# Altium schematic sheet power.SchDoc: Power Supply
size A4; ApprovedBy: Yves Chevallier; CheckedBy: Yves Chevallier; Author: Yves Chevallier; CompanyName: EPFL; DrawnBy: Yves Chevallier; Engineer: Yves Chevallier; Organization: EPFL; Address1: EPFL; Address2: CH1015 Lausanne; Address3: +41(0)21 693 36 98; Address4: +41(0)21 693 26 00; DocumentNumber: ABC.00.0000.000.0; Revision: v1.0; SheetNumber: 0; SheetTotal: 0; DrawnByDate: 2000-01-01; ExecutionWarrantDate: 2000-01-01; ExecutionWarrant: Yves Chevallier; Context: Confidential; PageSetup: Record=PageOptions|CenterHorizontal=True|CenterVertical=False|PrintScale=0.97|XCorrection=1.00|YCorrection=1.00|PrintKind=0|BorderSize=5000000|LeftOffset=0|BottomOffset=0|Orientation=2|PaperLength=1000|PaperWidth=1000|Scale=100|PaperSource=262|PrintQuality=600|MediaType=1|DitherType=10|PaperKind=A4|PrintScaleMode=1; EngineerDate: 2000-01-01; CheckedByDate: 2000-01-01; SVN: OUI; ProjectName: PRJ
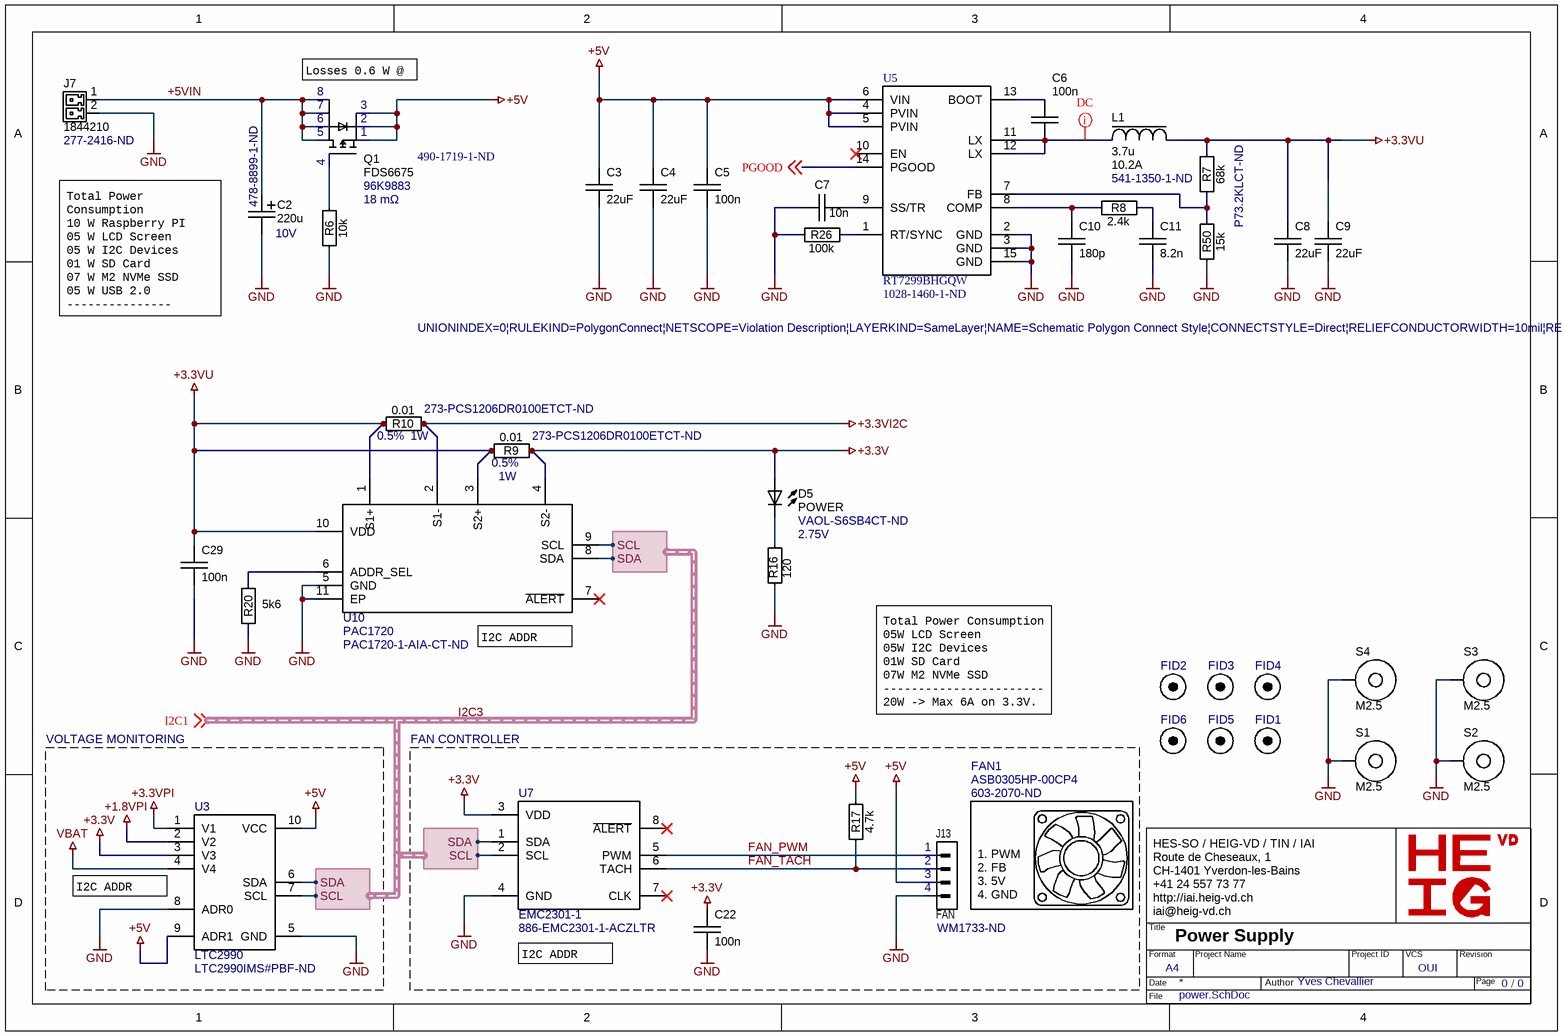
[diagram p0: power.SchDoc]

## Parts
C2  220u  Supplier Part Number 1: 478-8899-1-ND  Voltage: 10V  [CAPPM6032X280N]
C3  22uF  Rule: UNIONINDEX=0|RULEKIND=PolygonConnect|NETSCOPE=Violation Description|LAYERKIND=SameLayer|NAME=Schematic Polygon Connect Style|CONNECTSTYLE=Direct|RELIEFCONDUCTORWIDTH=10mil|RELIEFENTRIES=4|POLYGONRELIEFANGLE=45 Angle|AIRGAPWIDTH=10mil|UNIT=Imperial  Supplier Part Number 1: 490-1719-1-ND  [SM/C1210]
C4  22uF  [SM/C1210]
C5  100n  [SM/C0603]
C6  100n  [SM/C0603]
C7  10n  [SM/C0603]
C8  22uF  [SM/C1210]
C9  22uF  [SM/C1210]
C10  180p  [SM/C0603]
C11  8.2n  [SM/C0603]
C22  100n  [SM/C0603]
C29  100n  [SM/C0603]
D5  POWER  Supplier Part Number 1: VAOL-S6SB4CT-ND  Vf: 2.75V  [SM/LED0603]
FAN1  ASB0305HP-00CP4  Supplier Part Number 1: 603-2070-ND  (mechanical)
FID1  Fiducial 1.5 mm  [FIDUCIAL]  (value not drawn)  (no BOM)
FID2  Fiducial 1.5 mm  [FIDUCIAL]  (value not drawn)  (no BOM)
FID3  Fiducial 1.5 mm  [FIDUCIAL]  (value not drawn)  (no BOM)
FID4  Fiducial 1.5 mm  [FIDUCIAL]  (value not drawn)  (no BOM)
FID5  Fiducial 1.5 mm  [FIDUCIAL]  (value not drawn)  (no BOM)
FID6  Fiducial 1.5 mm  [FIDUCIAL]  (value not drawn)  (no BOM)
J7  1844210  Supplier Part Number 1: 277-2416-ND  [CONN2/PHOENIX/MC 1.5-2-G-3.5]
J13  FAN  [CONN4/MOLEX/1.25mm/53047-0410]
L1  3.7u  Isat: 10.2A  Supplier Part Number 1: 541-1350-1-ND  [IND_IHLP-3232DZ_VIS]
Q1  FDS6675  Supplier Part Number 1: 96K9883  Rdson: 18 mΩ  [SOIC8]
R6  10k  [SM/R0603]
R7  68k  Supplier Part Number 1: P73.2KLCT-ND  [SM/R0603]
R8  2.4k  [SM/R0603]
R9  0.01  Power: 1W  Precision: 0.5%  [SM/R1206]
R10  0.01  Power: 1W  Precision: 0.5%  [SM/R1206]
R16  120  [SM/R0603]
R17  4.7k  [SM/R0603]
R20  5k6  [SM/R0603]
R26  100k  [SM/R0603]
R50  15k  [SM/R0603]
S1  M2.5  [HW/HOLE/M2.5]  (no BOM)
S2  M2.5  [HW/HOLE/M2.5]  (no BOM)
S3  M2.5  [HW/HOLE/M2.5]  (no BOM)
S4  M2.5  [HW/HOLE/M2.5]  (no BOM)
U3  LTC2990  Supplier Part Number 1: LTC2990IMS#PBF-ND  [MSOP10]
U5  RT7299BHGQW  Supplier Part Number 1: 1028-1460-1-ND  [RT7299B]
U7  EMC2301-1  Supplier Part Number 1: 886-EMC2301-1-ACZLTR  [MSOP8]
U10  PAC1720  Supplier Part Number 1: PAC1720-1-AIA-CT-ND  [DFN10_3x3MC_MCH-M]

## Blocks framed on the sheet
VOLTAGE MONITORING: U3
FAN CONTROLLER: C22 FAN1 J13 R17 U7

## Harnesses
I2C: SDA, SCL

## Nets
+1.8VPI: U3.2(V2)
+3.3V: C22.1 D5.1 R9.2 U3.3(V3) U7.3(VDD) U10.4(S2-)
+3.3VI2C: R10.2 U10.2(S1-)
+3.3VPI: U3.1(V1)
+3.3VU: C8.1 C9.1 C29.1 L1.1 R7.1 R9.1 R10.1 U10.1(S1+) U10.3(S2+) U10.10(VDD)
+5V: C3.1 C4.1 C5.1 J13.3 Q1.1(S) Q1.2(S) Q1.3(S) R17.2 U3.9(ADR1) U3.10(VCC) U5.4(PVIN) U5.5(PVIN) U5.6(VIN)
GND: C2.2(-) C3.2 C4.2 C5.2 C7.1 C8.2 C9.2 C10.2 C11.2 C22.2 C29.2 J7.2 J13.4 R6.1 R16.2 R20.1 R26.2 R50.2 S1.1 S2.1 S3.1 S4.1 U3.5(GND) U3.8(ADR0) U5.2(GND) U5.3(GND) U5.15(GND) U7.4(GND) U10.5(GND) U10.11(EP)
VBAT: U3.4(V4)
+5VIN: C2.1(+) J7.1 Q1.5(D) Q1.6(D) Q1.7(D) Q1.8(D)
FAN_PWM: J13.1 U7.5(PWM)
FAN_TACH: J13.2 R17.1 U7.6(TACH)
I2C3.SCL: U3.7(SCL) U7.2(SCL) U10.9(SCL) ; harness I2C.SCL
I2C3.SDA: U3.6(SDA) U7.1(SDA) U10.8(SDA) ; harness I2C.SDA
PGOOD: U5.14(PGOOD) ; off-sheet PGOOD
NetC6_1: C6.1 U5.13(BOOT)
NetC6_2: C6.2 L1.2 U5.11(LX) U5.12(LX)
NetC7_2: C7.2 U5.9(SS/TR)
NetC10_1: C10.1 R8.2 U5.8(COMP)
NetC11_1: C11.1 R8.1
NetD5_2: D5.2 R16.1
NetQ1_4: Q1.4(G) R6.2
NetR7_2: R7.2 R50.1 U5.7(FB)
NetR20_2: R20.2 U10.6(ADDR_SEL)
NetR26_1: R26.1 U5.1(RT/SYNC)

Not connected (* = marked no-connect by the designer): U5 10(EN)*; U7 7(CLK)* 8(~{ALERT})*; U10 7(~{ALERT})*

## Layout directives
rule Polygon Connect Style [Style - Direct Connect]: NetC6_2

## Notes on the sheet
- (near Q1) Losses 0.6 W @ 6A
- (near C2) Total Power Consumption
  10 W Raspberry PI
  05 W LCD Screen
  05 W I2C Devices
  01 W SD Card
  07 W M2 NVMe SSD
  05 W USB 2.0
  ---------------
  30 W -> Max 6A on 5V.
- (near U10) I2C ADDR 0x2c
- Total Power Consumption
  05W LCD Screen
  05W I2C Devices
  01W SD Card
  07W M2 NVMe SSD
  -----------------------
  20W -> Max 6A on 3.3V.
- (near U3) I2C ADDR 0x4e
- (near U7) I2C ADDR 0x2e
- Labels drawn without touching a wire or pin: I2C1
- HES-SO / HEIG-VD / TIN / IAI
  Route de Cheseaux, 1
  CH-1401 Yverdon-les-Bains
  +41 24 557 73 77
  http://iai.heig-vd.ch
  iai@heig-vd.ch
- Title
- Format
- Date
- A4
- Project Name
- Author
- Project ID
- VCS
- Revision
- Page
- /
- File
- (in symbol FAN) 1. PWM; 2. FB; 3. 5V; 4. GND

## Library data of the parts
C2 = C+2312: CAP TANT 220UF 20% 10V 2312; Supplier 1: Digi-Key
C3 = C: CL32B226KPJVPNE; Supplier 1: Digi-Key
C4 C8 C9 = C: CL32B226KPJVPNE; Rule: UNIONINDEX=0|RULEKIND=PolygonConnect|NETSCOPE=Violation Description|LAYERKIND=SameLayer|NAME=Schematic Polygon Connect Style|CONNECTSTYLE=Direct|RELIEFCONDUCTORWIDTH=10mil|RELIEFENTRIES=4|POLYGONRELIEFANGLE=45 Angle|AIRGAPWIDTH=10mil|UNIT=Imperial; Supplier 1: Digi-Key; Supplier Part Number 1: 490-1719-1-ND
C5 C7 C10 C11 = C: Chip Capacitor; Voltage: 16V; Dielectric: X7R; Rule: UNIONINDEX=0|RULEKIND=PolygonConnect|NETSCOPE=Violation Description|LAYERKIND=SameLayer|NAME=Schematic Polygon Connect Style|CONNECTSTYLE=Direct|RELIEFCONDUCTORWIDTH=10mil|RELIEFENTRIES=4|POLYGONRELIEFANGLE=45 Angle|AIRGAPWIDTH=10mil|UNIT=Imperial; Supplier 1: Digi-Key; Supplier Part Number 1: 490-13243-1-ND; Supplier 2 Part Number: 1292-1393-1-ND; Supplier 2: Digi-Key
C6 C22 C29 = C: Chip Capacitor; Voltage: 16V; Dielectric: X7R; Supplier 2 Part Number: 1292-1393-1-ND; Supplier 2: Digi-Key
D5 = LED: Supplier 1: Digi-Key
FAN1 = FAN: Supplier 1: Digi-Key
FID1-FID6 = FIDUCIAL
J7 = CONN 2 PHOENIX 3.5 mm: TERM BLOCK HDR 2POS 90DEG 3.5MM; Imax: 8A; Supplier 1: Digi-Key
J13 = CONN 4 MALE: WM1733-ND; Supplier 1: Digi-Key; Supplier Part Number 1: WM1733-ND
L1 = L: IHLP3232DZER2R2M11; Value: 2.2uH; Rule: UNIONINDEX=0|RULEKIND=PolygonConnect|NETSCOPE=Violation Description|LAYERKIND=SameLayer|NAME=Schematic Polygon Connect Style|CONNECTSTYLE=Direct|RELIEFCONDUCTORWIDTH=10mil|RELIEFENTRIES=4|POLYGONRELIEFANGLE=45 Angle|AIRGAPWIDTH=10mil|UNIT=Imperial; Supplier 1: Digi-Key
Q1 = NDS9435A: MOSFET P-CH 30V 11A 8SOIC; Supplier 1: Newark
R6 R8 R16 R17 R20 R26 R50 = R: Chip Resistor SMD
R7 = R: RES 73.2 KOHMS 0.1% 0.15W 0603; Supplier 1: Digi-Key
R9 R10 = R: 273-PCS1206DR0100ETCT-ND; Rule: UNIONINDEX=0|RULEKIND=PolygonConnect|NETSCOPE=Violation Description|LAYERKIND=SameLayer|NAME=Schematic Polygon Connect Style|CONNECTSTYLE=Direct|RELIEFCONDUCTORWIDTH=10mil|RELIEFENTRIES=4|POLYGONRELIEFANGLE=45 Angle|AIRGAPWIDTH=10mil|UNIT=Imperial; Supplier 1: Digi-Key; Supplier Part Number 1: 273-PCS1206DR0100ETCT-ND
S1-S4 = HOLE/M2.5
U5 = RT7299B: Buck Switching Regulator IC Positive Adjustable 0.6V 1 Output 8A 14-WFQFN Exposed Pad; Supplier 1: Digi-Key
U7 = EMC2301: IC MOTOR DRIVER 3V-3.6V 8MSOP; Supplier 1: Mouser
U10 = PAC1720: Stromüberwachung Regler Hohe Seite  10-DFN (3x3); Supplier 1: Digi-Key
U3 = LTC2990: Supplier 1: Digi-Key